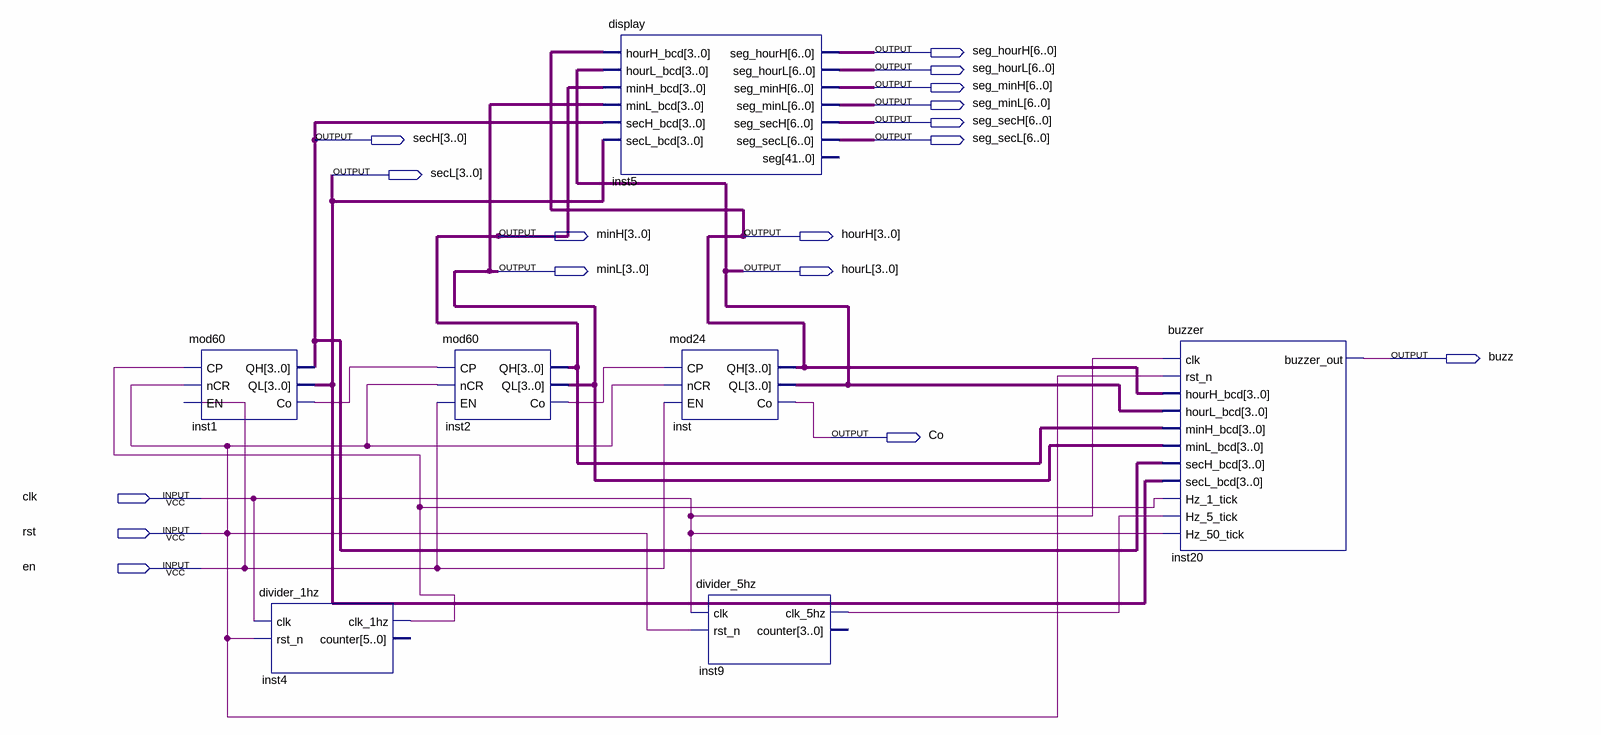
[diagram p0: schematic sheet]
// Quartus schematic final.bdf as structural Verilog: 7 symbols, 17 pins
module \final  (
  input  clk,
  input  rst,
  input  en,
  output [6:0] seg_hourH,
  output [6:0] seg_hourL,
  output [6:0] seg_minH,
  output [6:0] seg_minL,
  output [6:0] seg_secH,
  output [3:0] secH,
  output [6:0] seg_secL,
  output [3:0] secL,
  output [3:0] minH,
  output [3:0] hourH,
  output [3:0] minL,
  output [3:0] hourL,
  output buzz,
  output Co
);

  wire inst1_co, inst2_co, inst4_clk_1hz, inst9_clk_5hz;

  mod60 inst1 (.CP(inst4_clk_1hz), .nCR(rst), .EN(en), .QH(secH), .QL(secL), .Co(inst1_co));
  divider_1hz inst4 (.clk(clk), .rst_n(rst), .clk_1hz(inst4_clk_1hz));  // open: counter
  mod60 inst2 (.CP(inst1_co), .nCR(rst), .EN(en), .QH(minH), .QL(minL), .Co(inst2_co));
  display inst5 (
    .hourH_bcd(hourH), .hourL_bcd(hourL), .minH_bcd(minH), .minL_bcd(minL), .secH_bcd(secH), .secL_bcd(secL),
    .seg_hourH(seg_hourH), .seg_hourL(seg_hourL), .seg_minH(seg_minH), .seg_minL(seg_minL),
    .seg_secH(seg_secH), .seg_secL(seg_secL));  // open: seg
  mod24 inst (.CP(inst2_co), .nCR(rst), .EN(en), .QH(hourH), .QL(hourL), .Co(Co));
  divider_5hz inst9 (.clk(clk), .rst_n(rst), .clk_5hz(inst9_clk_5hz));  // open: counter
  buzzer inst20 (
    .clk(clk), .rst_n(rst), .hourH_bcd(hourH), .hourL_bcd(hourL), .minH_bcd(minH), .minL_bcd(minL),
    .secH_bcd(secH), .secL_bcd(secL), .Hz_1_tick(inst4_clk_1hz), .Hz_5_tick(inst9_clk_5hz), .Hz_50_tick(clk),
    .buzzer_out(buzz));
endmodule
